# Altium schematic sheet USB.SchDoc: GESTION USB / UART
size A4; CheckedBy: P. FISCHER; Author: A. LANDREAU; CompanyName: LE GROUPE DE 5; DrawnBy: A. LANDREAU et P. FISCHER; DocumentNumber: SCH_CARTE_MONITORING_PERMANENT_0; Revision: A.0; SheetNumber: 6; SheetTotal: 7
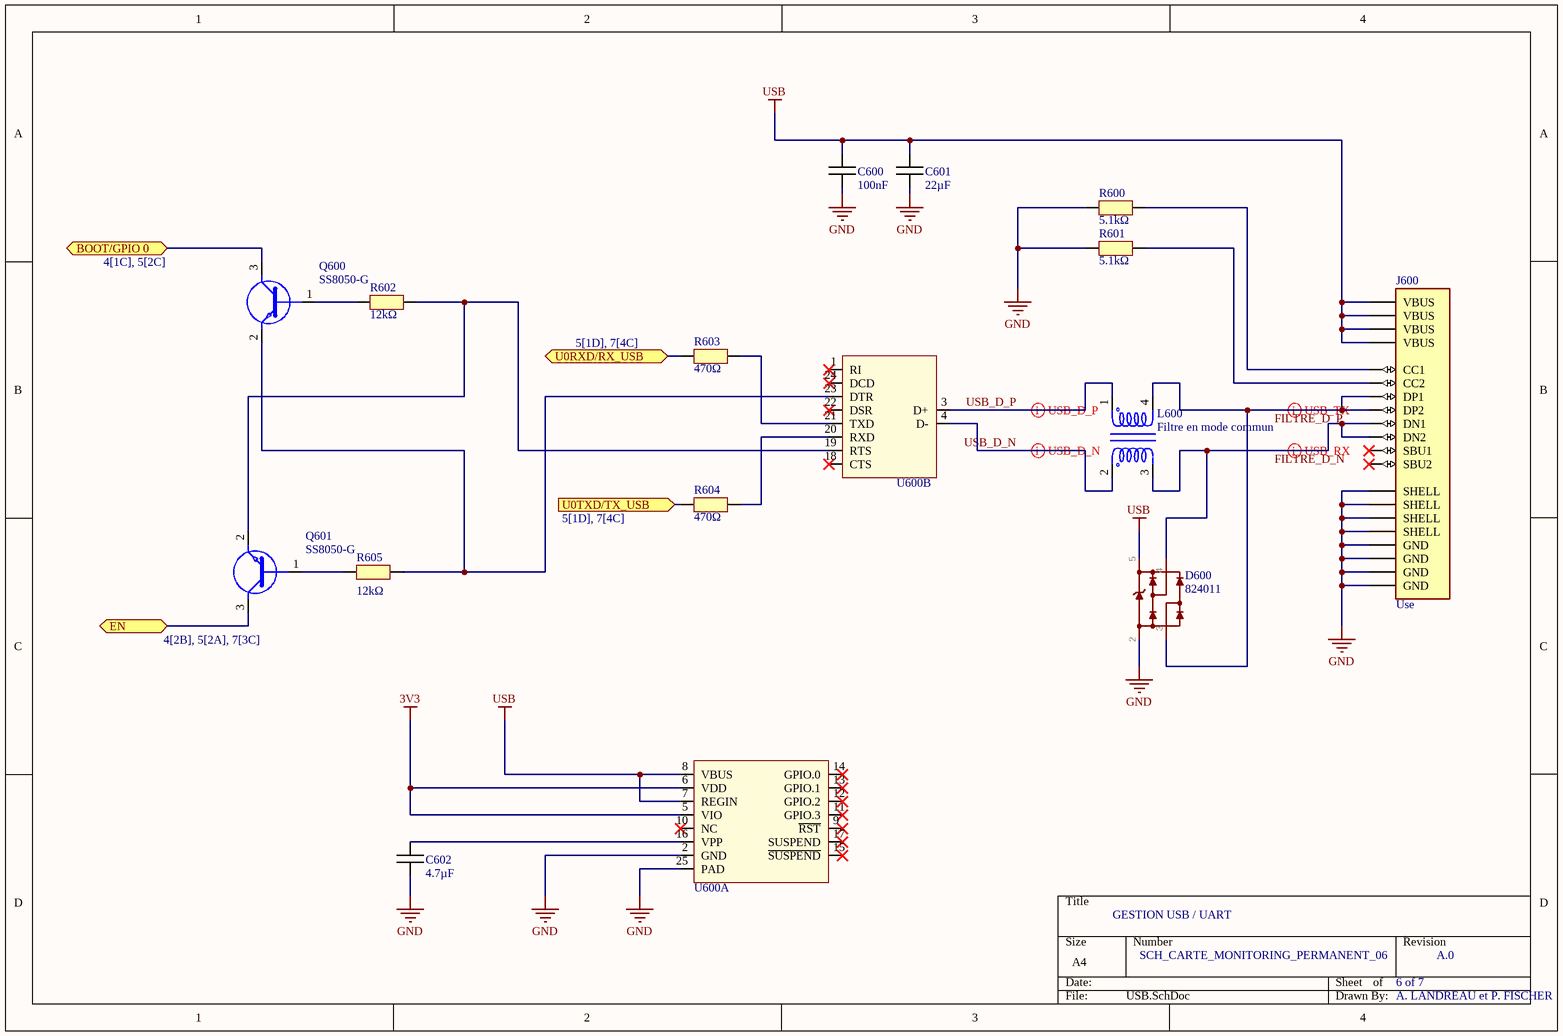
[diagram p0: USB.SchDoc]

## Parts
C600  100nF  [CAPC1005X06N]
C601  22µF  [CAPC1005X06N]
C602  4.7µF  [CAPC1005X06N]
D600  824011  [824011]
J600  Use  [USB4085-GF-A]
L600  Filtre en mode commun  [744232090]
Q600  SS8050-G  [SS8050-G]
Q601  SS8050-G  [SS8050-G]
R600  5.1kΩ  [RESC1005X06N]
R601  5.1kΩ  [RESC1005X06N]
R602  12kΩ  [RESC1005X06N]
R603  470Ω  [RESC1005X06N]
R604  470Ω  [RESC1005X06N]
R605  12kΩ  [RESC1005X06N]
U600  CP2104-F03-GM  [PQFN50P400X400X80_HS-25N]  (value not drawn)  (parts A,B of 2)

## Ports
BOOT/GPIO 0 (bidir, see 4[1C], 5[2C]), EN (bidir, see 4[2B], 5[2A], 7[3C]), U0RXD/RX_USB (bidir, see 5[1D], 7[4C]), U0TXD/TX_USB (in, see 5[1D], 7[4C])

## Nets
3V3: U600.5(VIO) U600.6(VDD)
GND: C600.2 C601.2 C602.2 D600.2(GND) J600.A1(GND) J600.A12(GND) J600.B1(GND) J600.B12(GND) J600.S1(SHELL) J600.S2(SHELL) J600.S3(SHELL) J600.S4(SHELL) R600.1 R601.1 U600.2(GND) U600.25(PAD)
USB: C600.1 C601.1 D600.5(VDD) J600.A4(VBUS) J600.A9(VBUS) J600.B4(VBUS) J600.B9(VBUS) U600.7(REGIN) U600.8(VBUS)
BOOT/GPIO 0: Q600.3(C) ; port BOOT/GPIO 0
EN: Q601.3(C) ; port EN
FILTRE_D_N: D600.4 J600.A7(DN1) J600.B7(DN2) L600.3
FILTRE_D_P: D600.3 J600.A6(DP1) J600.B6(DP2) L600.4
U0RXD/RX_USB: R603.1 ; port U0RXD/RX_USB
U0TXD/TX_USB: R604.1 ; port U0TXD/TX_USB
USB_D_N: L600.2 U600.4(D-)
USB_D_P: L600.1 U600.3(D+)
NetC602_1: C602.1 U600.16(VPP)
NetJ600_A5: J600.A5(CC1) R600.2
NetJ600_B5: J600.B5(CC2) R601.2
NetQ600_1: Q600.1(B) R602.1
NetQ600_2: Q600.2(E) R605.2 U600.23(DTR)
NetQ601_1: Q601.1(B) R605.1
NetQ601_2: Q601.2(E) R602.2 U600.19(RTS)
NetR603_2: R603.2 U600.21(TXD)
NetR604_2: R604.2 U600.20(RXD)

Not connected (* = marked no-connect by the designer): J600 A8(SBU1)* B8(SBU2)*; U600 1(RI)* 9(~{RST})* 10(NC)* 11(GPIO.3)* 12(GPIO.2)* 13(GPIO.1)* 14(GPIO.0)* 15(~{SUSPEND})* 17(SUSPEND)* 18(CTS)* 22(DSR)* 24(DCD)*

## Layout directives
differential pair; rule Differential Pairs Routing [Pref Gap = 0.127mm    Min Gap  = 0.127mm    Max Gap  = 0.127mmPref Width = 0.303mm    Min Width  = 0.109mm    Max Width  = 0.303mm]: FILTRE_D_N, FILTRE_D_P, USB_D_N, USB_D_P

## Library data of the parts
C600-C602 = Capacitor
D600 = 824011: TVS Diode Array WE-TVS, High Speed Series  - Low capazity - No leakage current - Low clamping voltage - high ESD voltage protection  -- USB 1.0 - 2.0
J600 = USB4085-GF-A: Connecteurs USB USB Type C, 2.0, Rec, TH , G/F, RA , Top Mnt, T & R
L600 = 744232090: Bobines / filtres en mode commun WE-CNSW 1206 370mA 90Ohm 100MHz AECQ200
Q600 Q601 = SS8050-G: Bipolar Transistors - BJT NPN TRANSISTOR 1.5A 40V
R600-R605 = Resistor
U600 = USBBridge: USB Bridge, USB to UART USB 2.0 UART Interface 24-QFN (4x4); Manufacturer 1: Silicon Labs; Supplier 1: Arrow Electronics; Supplier Part Number 1: CP2104-F03-GM; Manufacturer Part Number 1: CP2104-F03-GM